# EAGLE design PhoneRinger_v1-2 (EAGLE 9.6.2)

## Sheet 1 of 2
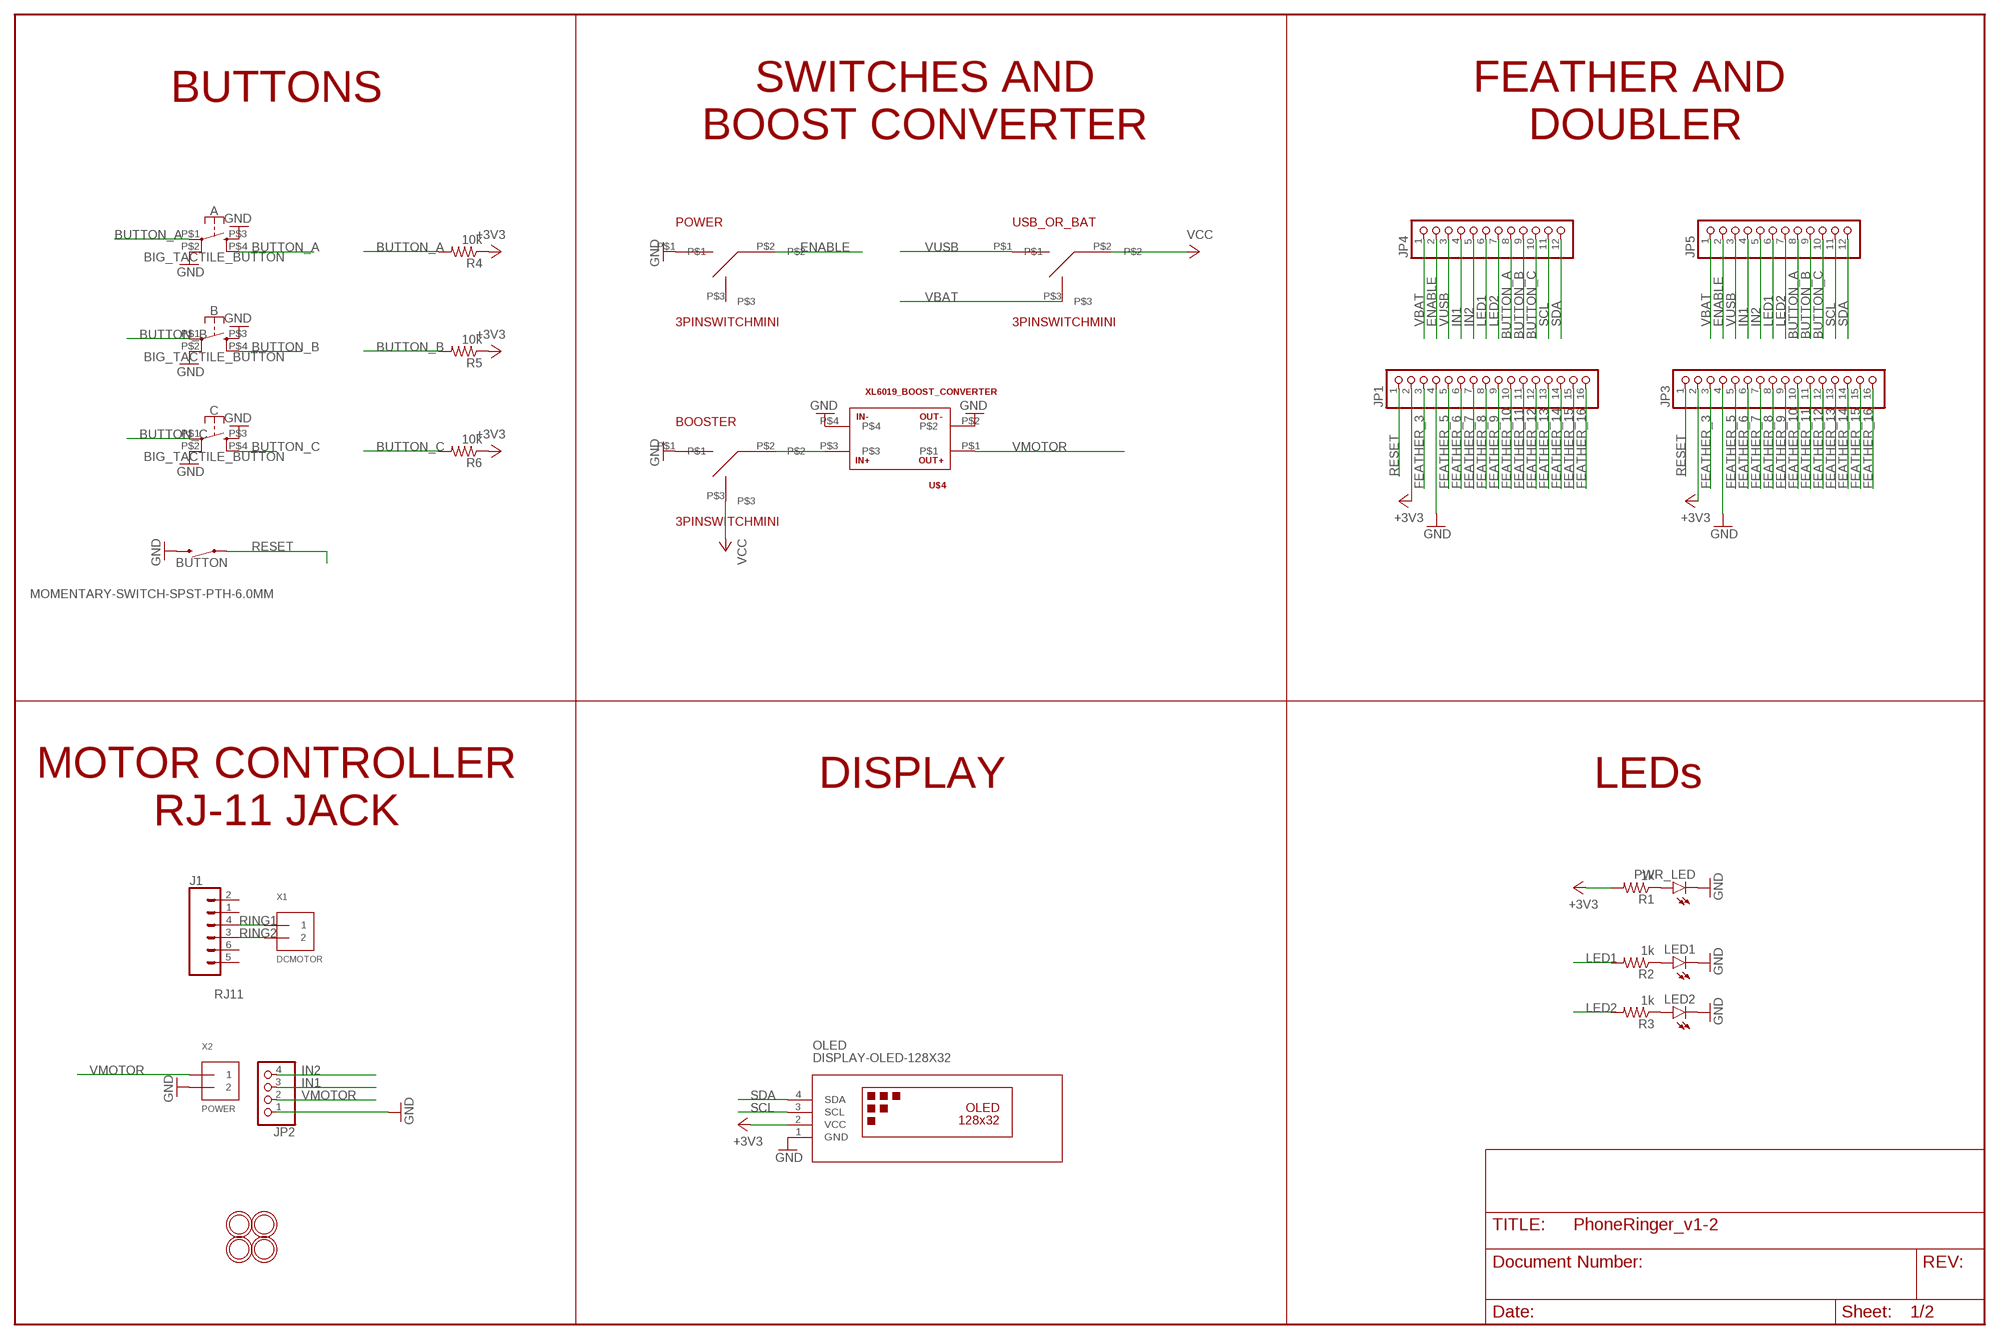
[diagram p0: schematic, sheet 1]

### Parts
A  BIG_TACTILE_BUTTON  [BIG_TACTILE_BUTTON_FP]
B  BIG_TACTILE_BUTTON  [BIG_TACTILE_BUTTON_FP]
BOOSTER  3PINSWITCHMINI  [3PINMINI]
BUTTON  MOMENTARY-SWITCH-SPST-PTH-6.0MM  [TACTILE_SWITCH_PTH_6.0MM]
C  BIG_TACTILE_BUTTON  [BIG_TACTILE_BUTTON_FP]
J1  RJ11  RJ11-6  [RJ11-6]
JP1  HEADER-1X16_76MIL  [1X16_ROUND_76MIL]
JP2  HEADER-1X476MIL  [1X04_ROUND_76]
JP3  HEADER-1X16_76MIL  [1X16_ROUND_76MIL]
JP4  HEADER-1X1276MIL  [1X12_ROUND_76MIL]
JP5  HEADER-1X1276MIL  [1X12_ROUND_76MIL]
LED1  LED5MM  [LED5MM]
LED2  LED5MM  [LED5MM]
OLED  DISPLAY-OLED-128X32  [DISPLAY-OLED-128X32]
POWER  3PINSWITCHMINI  [3PINMINI]
PWR_LED  LED5MM  [LED5MM]
R1  1k  R-US_0207/10  [0207/10]
R2  1k  R-US_0207/10  [0207/10]
R3  1k  R-US_0207/10  [0207/10]
R4  10k  R-US_0207/10  [0207/10]
R5  10k  R-US_0207/10  [0207/10]
R6  10k  R-US_0207/10  [0207/10]
U$4  XL6019_BOOST_CONVERTER  [XL6019_FP]
U$5  MICROBUILDER_MOUNTINGHOLE2.5_THICK  [MICROBUILDER_MOUNTINGHOLE_2.5_PLATED_THICK]
U$6  MICROBUILDER_MOUNTINGHOLE2.5_THICK  [MICROBUILDER_MOUNTINGHOLE_2.5_PLATED_THICK]
U$7  MICROBUILDER_MOUNTINGHOLE2.5_THICK  [MICROBUILDER_MOUNTINGHOLE_2.5_PLATED_THICK]
U$8  MICROBUILDER_MOUNTINGHOLE2.5_THICK  [MICROBUILDER_MOUNTINGHOLE_2.5_PLATED_THICK]
USB_OR_BAT  3PINSWITCHMINI  [3PINMINI]
X1  DCMOTOR  TERMBLOCK_1X2  [TERMBLOCK_1X2-3.5MM]
X2  POWER  TERMBLOCK_1X2  [TERMBLOCK_1X2-3.5MM]

### Nets
+3V3 [PWR]: JP1.2 JP3.2 OLED.2(VCC) R1.2 R4.1 R5.1 R6.1
BUTTON_A: A.P$1 A.P$4 JP4.8 JP5.8 R4.2
BUTTON_B: B.P$1 B.P$4 JP4.9 JP5.9 R5.2
BUTTON_C: C.P$1 C.P$4 JP4.10 JP5.10 R6.2
ENABLE: JP4.2 JP5.2 POWER.P$2
FEATHER_3: JP1.3 JP3.3
FEATHER_5: JP1.5 JP3.5
FEATHER_6: JP1.6 JP3.6
FEATHER_7: JP1.7 JP3.7
FEATHER_8: JP1.8 JP3.8
FEATHER_9: JP1.9 JP3.9
FEATHER_10: JP1.10 JP3.10
FEATHER_11: JP1.11 JP3.11
FEATHER_12: JP1.12 JP3.12
FEATHER_13: JP1.13 JP3.13
FEATHER_14: JP1.14 JP3.14
FEATHER_15: JP1.15 JP3.15
FEATHER_16: JP1.16 JP3.16
GND [PWR]: A.P$2 A.P$3 B.P$2 B.P$3 BOOSTER.P$1 BUTTON.3 C.P$2 C.P$3 JP1.4 JP2.1 JP3.4 LED1.K(C) LED2.K(C) OLED.1(GND) POWER.P$1 PWR_LED.K(C) U$4.P$2 U$4.P$4 X2.2
IN1: JP2.3 JP4.4 JP5.4
IN2: JP2.4 JP4.5 JP5.5
LED1: JP4.6 JP5.6 R2.2
LED2: JP4.7 JP5.7 R3.2
N$1: PWR_LED.A R1.1
N$2: LED1.A R2.1
N$3: LED2.A R3.1
N$8: BOOSTER.P$2 U$4.P$3
RESET: BUTTON.1 JP1.1 JP3.1
RING1 [PWR]: J1.4 X1.1
RING2 [PWR]: J1.3 X1.2
SCL: JP4.11 JP5.11 OLED.3(SCL)
SDA: JP4.12 JP5.12 OLED.4(SDA)
VBAT [PWR]: JP4.1 JP5.1 USB_OR_BAT.P$3
VCC: BOOSTER.P$3 USB_OR_BAT.P$2
VMOTOR [PWR]: JP2.2 U$4.P$1 X2.1
VUSB [PWR]: JP4.3 JP5.3 USB_OR_BAT.P$1
Unconnected: J1.1 J1.2 J1.5 J1.6 POWER.P$3

### Notes on the sheet
- BUTTONS
- SWITCHES AND
  BOOST CONVERTER
- FEATHER AND 
  DOUBLER
- DISPLAY | LEDs
- MOTOR CONTROLLER
  RJ-11 JACK

## Sheet 2 of 2

## Library data of the parts
A B C = TrophyParts:BIG_TACTILE_BUTTON
BOOSTER POWER USB_OR_BAT = TrophyParts:3PINSWITCHMINI
BUTTON = TrophyParts:MOMENTARY-SWITCH-SPST: Momentary Switch (Pushbutton) - SPST Normally-open (NO) SPST momentary switches (buttons, pushbuttons). Variants PTH-12MM - 12mm square, through-hole Momentary Pushbutton Switch - 12mm Square <https://www.sparkfun.com/products/9190> (COM-09190) PTH-6.0MM, PTH-6.0MM-KIT - 6.0mm square, through-hole Mini Pushbutton Switch <https://www.sparkfun.com/products/97> (COM-00097) KIT package intended for soldering kit's - only one side of pads' copper is exposed. PTH-RIGHT-ANGLE-KIT - Right-angle, through-hole Right Angle Tactile Button <https://www.sparkfun.com/products/10791> - Used on SparkFun BigTime Watch Kit <https://www.sparkfun.com/products/11734> SMD-12MM - 12mm square, surface-mount Tactile Button - SMD (12mm) <https://www.sparkfun.com/products/12993> (COM-12993) Used on SparkFun PicoBoard <https://www.sparkfun.com/products/11888> SMD-4.5MM - 4.5mm Square Trackball Switch Used on SparkFun Blackberry Trackballer Breakout <https://www.sparkfun.com/products/13169> SMD-4.6MMX2.8MM - 4.60mm x 2.80mm, surface mount Used on SparkFun SAMD21 Mini Breakout <https://www.sparkfun.com/products/13664> SMD-5.2MM, SMD-5.2-REDUNDANT - 5.2mm square, surface-mount Mini Pushbutton Switch - SMD <https://www.sparkfun.com/products/8720> (COM-08720) Used on Arduino Pro Mini <https://www.sparkfun.com/products/11114> REDUNDANT package connects both switch circuits together SMD-6.0X3.5MM - 6.0 x 3.5mm, surface mount Momentary Reset Switch SMD <https://www.sparkfun.com/products/8229> (COM-08229) SMD-6.2MM-TALL - 6.2mm square, surface mount Tactile Button - SMD (6mm) <https://www.sparkfun.com/products/12992> Used on SparkFun Digital Sandbox <https://www.sparkfun.com/products/12651> SMD-RIGHT-ANGLE - Right-angle, surface mount Used on SparkFun Block for Intel® Edison - Arduino <https://www.sparkfun.com/products/13036>; PROD_ID: SWCH-08441; SF_SKU: COM-00097
J1 = TrophyParts:RJ11-6: RJ11 Jack - 6 pin Commonly found on CAT3 devices and some Microchip programmers. Here is the connector we sell at SparkFun: RJ11 6-Pin Connector <https://www.sparkfun.com/products/132> (PRT-00132) Datasheet <http://www.sparkfun.com/datasheets/Prototyping/Connectors/RJ11-Datasheet.pdf> It is used on this SparkFun product: SparkFun Weather Shield <https://www.sparkfun.com/products/12081> (DEV-12081) Weather Meters <https://www.sparkfun.com/products/8942> (SEN-08942); PROD_ID: CONN-08590; SF_ID: PRT-00132
JP1 JP3 = microbuilder:HEADER-1X16: PIN HEADER
JP2 = microbuilder:HEADER-1X4: PIN HEADER
JP4 JP5 = microbuilder:HEADER-1X12
LED1 LED2 PWR_LED = led:LED: LED OSRAM: - CHIPLED LG R971, LG N971, LY N971, LG Q971, LY Q971, LO R971, LY R971 LH N974, LH R974 LS Q976, LO Q976, LY Q976 LO Q996 - Hyper CHIPLED LW Q18S LB Q993, LB Q99A, LB R99A - SideLED LS A670, LO A670, LY A670, LG A670, LP A670 LB A673, LV A673, LT A673, LW A673 LH A674 LY A675 LS A676, LA A676, LO A676, LY A676, LW A676 LS A679, LY A679, LG A679 - Hyper Micro SIDELED® LS Y876, LA Y876, LO Y876, LY Y876 LT Y87S - SmartLED LW L88C, LW L88S LB L89C, LB L89S, LG L890 LS L89K, LO L89K, LY L89K LS L896, LA L896, LO L896, LY L896 - TOPLED LS T670, LO T670, LY T670, LG T670, LP T670 LSG T670, LSP T670, LSY T670, LOP T670, LYG T670 LG T671, LOG T671, LSG T671 LB T673, LV T673, LT T673, LW T673 LH T674 LS T676, LA T676, LO T676, LY T676, LB T676, LH T676, LSB T676, LW T676 LB T67C, LV T67C, LT T67C, LS T67K, LO T67K, LY T67K, LW E67C LS E67B, LA E67B, LO E67B, LY E67B, LB E67C, LV E67C, LT E67C LW T67C LS T679, LY T679, LG T679 LS T770, LO T770, LY T770, LG T770, LP T770 LB T773, LV T773, LT T773, LW T773 LH T774 LS E675, LA E675, LY E675, LS T675 LS T776, LA T776, LO T776, LY T776, LB T776 LHGB T686 LT T68C, LB T68C - Hyper Mini TOPLED® LB M676 - Mini TOPLED Santana® LG M470 LS M47K, LO M47K, LY M47K Source: http://www.osram.convergy.de LUXEON: - LUMILED® LXK2-PW12-R00, LXK2-PW12-S00, LXK2-PW14-U00, LXK2-PW14-V00 LXK2-PM12-R00, LXK2-PM12-S00, LXK2-PM14-U00 LXK2-PE12-Q00, LXK2-PE12-R00, LXK2-PE12-S00, LXK2-PE14-T00, LXK2-PE14-U00 LXK2-PB12-K00, LXK2-PB12-L00, LXK2-PB12-M00, LXK2-PB14-N00, LXK2-PB14-P00, LXK2-PB14-Q00 LXK2-PR12-L00, LXK2-PR12-M00, LXK2-PR14-Q00, LXK2-PR14-R00 LXK2-PD12-Q00, LXK2-PD12-R00, LXK2-PD12-S00 LXK2-PH12-R00, LXK2-PH12-S00 LXK2-PL12-P00, LXK2-PL12-Q00, LXK2-PL12-R00 Source: www.luxeon.com KINGBRIGHT: KA-3528ASYC Source: www.kingbright.com
OLED = Hatch2020:DISPLAY-OLED-128X32: 128x32 Dot Matrix OLED Module with I2C interface based on SSD1306 chip More details available here: http://www.tinyosshop.com/index.php?route=product/product&product_id=953 Schematic available here: http://www.tinyosshop.com/datasheet/OLED%2012832.pdf SSD1306 datasheet: https://cdn-shop.adafruit.com/datasheets/SSD1306.pdf Click here to find device on ebay.com <http://www.ebay.com/sch/oled+display+128x32+i2c>
R1-R6 = rcl:R-US_: RESISTOR, American symbol; SPICEPREFIX: R
U$4 = TrophyParts:XL6019_BOOST_CONVERTER
U$5-U$8 = OLED_2:MICROBUILDER_MOUNTINGHOLE: Mounting Hole For #2 screws (0.086"/2.18mm width, 0.094"/2.4mm hole) use 2.5mm; BOM: EXCLUDE
X1 X2 = microbuilder:TERMBLOCK_1X2: 3.5mm Terminal block http://www.ladyada.net/library/pcb/eaglelibrary.html

## Net classes
1 PWR: width 0.508 mm

## Board
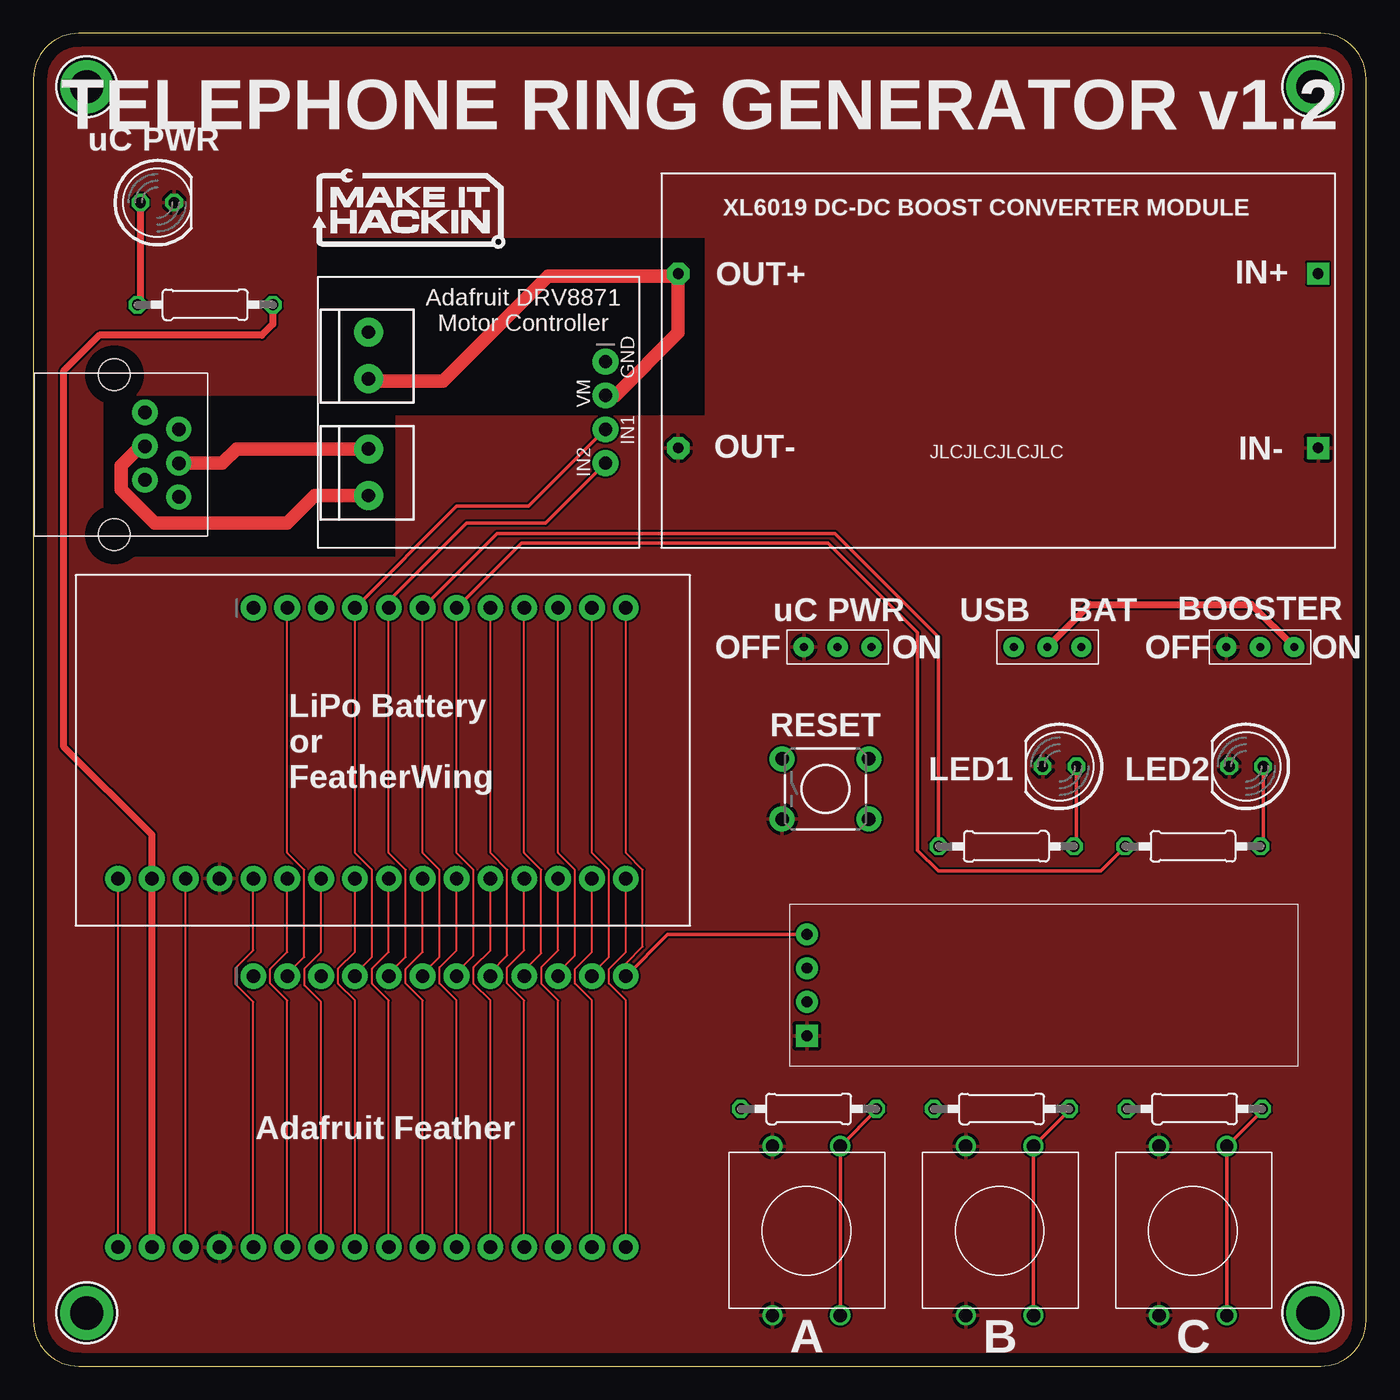
[diagram p1: board, top side]
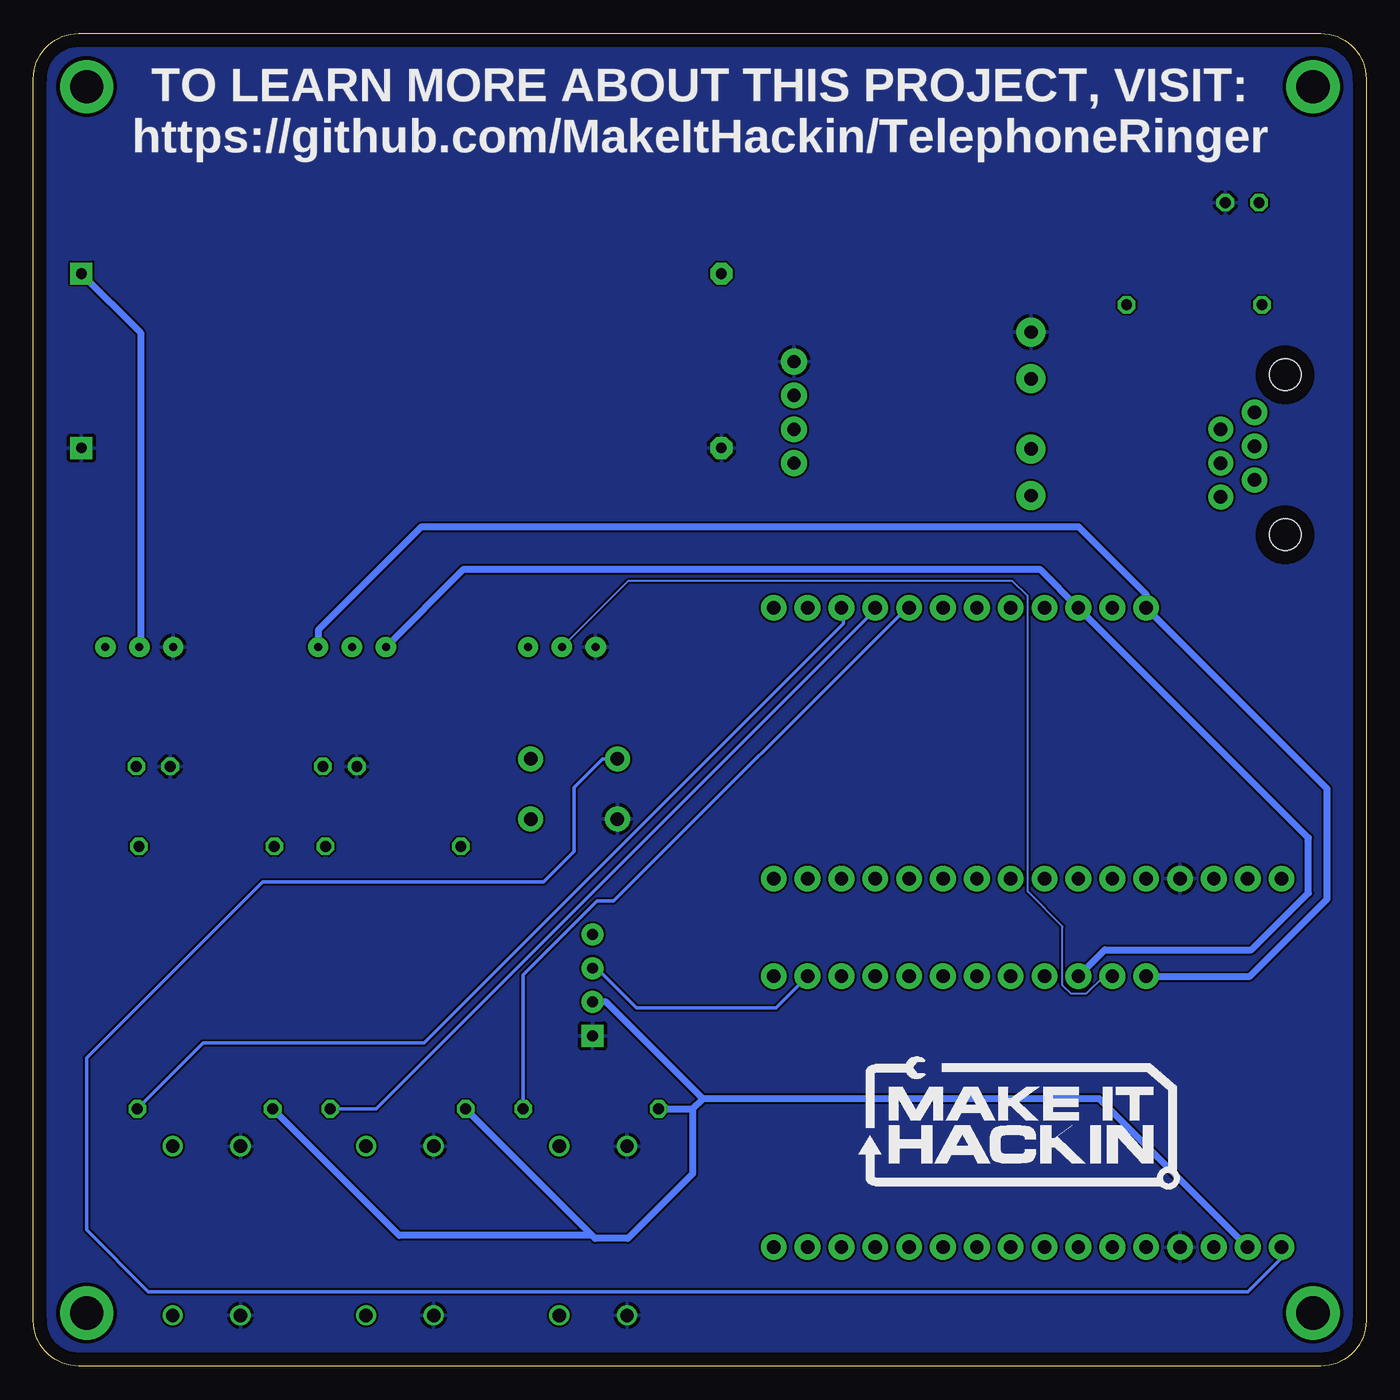
[diagram p2: board, bottom side, seen from below]

Size 100 x 100 mm. Coordinates in mm from the lower left corner, seen from the top.
Outline: 0,96.59 0,3.41 arc90 3.41,0 96.59,0 arc90 100,3.41 100,96.59 arc90 96.59,100 3.41,100 arc90 0,96.59
Copper layers (1*16): Top 0.035mm / dielectric 1.5mm / Bottom 0.035mm
Design rules "default": minimum track width 6mil, minimum drill 0.35mm, track to track 6mil, track to pad 6mil, pad to pad 6mil, via to via 6mil, smd to smd 6mil, copper to edge 40mil, drill to drill 6mil, minimum pad ring 10mil, minimum via ring 8mil, stop-mask expansion 4mil, vias tented up to drill 0mil, thermal gap 10mil
tRestrict: area 5.3,60.8 to 27.2,72.8; area 21.3,71.4 to 50.3,84.6

### Footprints (pad centres in the part's own frame; a part is rotated, then mirrored left to right if it is on the bottom)
BIG_TACTILE_BUTTON_FP = drill 1: P$1 2.54,-6.35; P$2 -2.54,-6.35; P$3 -2.54,6.35; P$4 2.54,6.35
3PINMINI = drill 0.6 pad 1.524: P$1 1.27,3.81; P$2 3.81,3.81; P$3 6.35,3.81
TACTILE_SWITCH_PTH_6.0MM = drill 1.016 pad 1.88: 1 -3.251,2.261; 2 3.251,2.261; 3 -3.251,-2.261; 4 3.251,-2.261
RJ11-6 = drill 1.016 pad 1.88: 1 3.175,4.44; 2 1.905,1.9; 3 0.635,4.44; 4 -0.635,1.9; 5 -1.905,4.44; 6 -3.175,1.9 | hole 2.36: -6,-0.4; 6,-0.4
1X16_ROUND_76MIL = drill 1 pad 1.93: 1 -19.05,0; 2 -16.51,0; 3 -13.97,0; 4 -11.43,0; 5 -8.89,0; 6 -6.35,0; 7 -3.81,0; 8 -1.27,0; 9 1.27,0; 10 3.81,0; 11 6.35,0; 12 8.89,0; 13 11.43,0; 14 13.97,0; 15 16.51,0; 16 19.05,0
1X04_ROUND_76 = drill 1 pad 1.93: 1 -3.81,0; 2 -1.27,0; 3 1.27,0; 4 3.81,0
1X12_ROUND_76MIL = drill 1 pad 1.93: 1 -13.97,0; 2 -11.43,0; 3 -8.89,0; 4 -6.35,0; 5 -3.81,0; 6 -1.27,0; 7 1.27,0; 8 3.81,0; 9 6.35,0; 10 8.89,0; 11 11.43,0; 12 13.97,0
LED5MM = drill 0.813 octagon: A -1.27,0; K 1.27,0
DISPLAY-OLED-128X32 = drill 0.813 pad 1.651 square: 1 -17.78,-3.81 | drill 0.813 pad 1.651: 2 -17.78,-1.27; 3 -17.78,1.27; 4 -17.78,3.81
0207/10 = drill 0.813 octagon: 1 -5.08,0; 2 5.08,0
XL6019_FP = drill 0.813 pad 1.651 octagon: P$1 -23.368,6.985; P$2 -23.368,-6.096 | drill 0.813 pad 1.651 square: P$3 24.638,6.985; P$4 24.638,-6.096
MICROBUILDER_MOUNTINGHOLE_2.5_PLATED_THICK = drill 2.5 pad 4: P$1 0,0
TERMBLOCK_1X2-3.5MM = drill 1 pad 2.184: 1 1.8,0; 2 -1.7,0

### Placement (x,y rotation side)
A  58,10.16 0 top
B  72.5,10.16 0 top
BOOSTER  88.24,50.15 0 top
BUTTON  59.44,43.31 0 top
C  87,10.16 0 top
J1  6.48,68.39 270 top
JP1  25.4,8.94 0 top
JP2  42.93,71.56 270 top
JP3  25.4,36.58 0 top
JP4  30.48,29.26 0 top
JP5  30.48,56.9 0 top
LED1  77,45 180 top
LED2  91,45 180 top
OLED  75.82,28.59 0 top
POWER  56.53,50.15 0 top
PWR_LED  9.3,87.3 0 top
R1  12.89,79.63 0 top
R2  73,39 180 top
R3  87,39 180 top
R4  58.17,19.3 0 top
R5  72.64,19.3 0 top
R6  87.12,19.3 0 top
U$4  71.75,74.99 0 top
U$5  4,4 0 top
U$6  4,96 0 top
U$7  96,4 0 top
U$8  96,96 0 top
USB_OR_BAT  72.28,50.15 0 top
X1  25.15,67.12 270 top
X2  25.15,75.88 270 top

### Tracks (layer width: path | path; a pad name or v marks a point on that pad's centre or on a via)
+3V3
  Top 0.508: R1.2 17.97,78.17 17.15,77.35 4.96,77.35 2.26,74.65 2.26,46.51 8.89,39.88 JP3.2 JP1.2
  Bottom 0.508: JP1.2 20.02,20.07 49.77,20.07 | 49.77,20.07 57.02,27.32 OLED.2 | R4.1 50.53,19.3 | 50.53,19.3 49.77,20.07 | 67.31,19.3 R5.1 58.06,9.8 | 50.53,19.3 50.53,14.44 55.4,9.58 57.84,9.58 58.06,9.8 | 58.06,9.8 72.54,9.8 R6.1
BUTTON_A
  Top 0.152: JP4.8 34.29,29.55 35.56,30.82 35.56,37.25 34.29,38.52 JP5.8
  Top 0.254: A.P$4 60.54,16.31 | 60.54,16.31 A.P$1 | A.P$4 60.54,16.53 | 60.68,16.45 60.54,16.31 | A.P$4 63.25,19.22 R4.2
  Bottom 0.254: JP5.8 34.47,56.9 56.46,34.9 57.71,34.9 63.25,29.36 R4.2
BUTTON_B
  Top 0.152: JP4.9 36.83,29.7 38.1,30.97 38.1,37.25 36.83,38.52 JP5.9
  Top 0.254: B.P$1 B.P$4 77.72,19.19 R5.2
  Bottom 0.254: JP5.9 36.98,56.74 36.98,56.62 74.3,19.3 R5.2
BUTTON_C
  Top 0.152: JP4.10 39.37,29.55 40.64,30.82 40.64,37.25 39.37,38.52 JP5.10
  Top 0.254: C.P$1 C.P$4 92.2,19.17 R6.2
  Bottom 0.254: JP5.10 39.22,56.74 39.22,55.7 70.67,24.26 87.25,24.26 R6.2
ENABLE
  Top 0.152: JP4.2 19.05,29.42 20.32,30.69 20.32,37.25 19.05,38.52 JP5.2
  Bottom 0.152: JP4.2 19.7,29.26 21.02,27.94 22.14,27.94 22.78,28.59 22.78,32.99 25.4,35.61 25.4,57.77 26.53,58.9 55.4,58.9 POWER.P$2
  Bottom 0.254: 19.1,29.26 JP4.2
FEATHER_3
  Top 0.152: JP1.3 JP3.3
FEATHER_5
  Top 0.152: JP1.5 16.51,27.32 15.19,28.64 15.19,29.88 16.51,31.2 JP3.5
FEATHER_6
  Top 0.152: JP1.6 19.05,27.44 17.78,28.71 17.78,29.8 19.05,31.07 JP3.6
FEATHER_7
  Top 0.152: JP1.7 21.59,27.32 20.34,28.56 20.34,29.83 21.59,31.07 JP3.7
FEATHER_8
  Top 0.152: JP1.8 24.13,27.44 22.89,28.69 22.89,29.83 24.13,31.07 JP3.8
FEATHER_9
  Top 0.152: JP1.9 26.67,27.44 25.43,28.69 25.43,29.83 26.67,31.07 JP3.9
FEATHER_10
  Top 0.152: JP1.10 29.21,27.44 27.94,28.71 27.94,29.8 29.21,31.07 JP3.10
FEATHER_11
  Top 0.152: JP1.11 31.75,27.44 30.48,28.71 30.48,29.93 31.75,31.2 JP3.11
FEATHER_12
  Top 0.152: JP1.12 34.29,27.44 33.05,28.69 33.05,29.95 34.29,31.2 JP3.12
FEATHER_13
  Top 0.152: JP1.13 36.83,27.44 35.56,28.71 35.56,29.93 36.83,31.2 JP3.13
FEATHER_14
  Top 0.152: JP1.14 39.37,27.44 38.12,28.69 38.12,29.95 39.37,31.2 JP3.14
FEATHER_15
  Top 0.152: JP1.15 41.91,27.44 40.64,28.71 40.64,29.8 41.91,31.07 JP3.15
FEATHER_16
  Top 0.152: JP1.16 44.45,27.44 43.18,28.71 43.18,29.8 44.45,31.07 JP3.16
GND
  pour Top: -1.27,100.33 101.35,100.33 arc-90 101.6,100.08 101.6,-1.27 -1.02,-1.27 arc-90 -1.27,-1.02
  pour Bottom: -1.27,101.6 102.62,101.6 arc-90 102.87,101.35 102.87,-2.54 -2.29,-2.54 arc-90 -2.54,-2.29 -2.54,101.6
IN1
  Top 0.152: JP4.4 24.13,29.42 25.4,30.69 25.4,37.25 24.13,38.52 JP5.4
  Top 0.254: JP2.3 37.15,64.52 31.75,64.52 JP5.4
IN2
  Top 0.152: JP4.5 26.67,29.42 27.94,30.69 27.94,37.25 26.67,38.52 JP5.5
  Top 0.254: JP5.5 26.67,57.4 32.51,63.25 38.42,63.25 JP2.4
LED1
  Top 0.152: JP4.6 29.21,29.42 30.48,30.69 30.48,37.25 29.21,38.52 JP5.6
  Top 0.254: JP5.6 34.8,62.48 60.15,62.48 67.92,54.71 R2.2
LED2
  Top 0.152: JP4.7 31.75,29.55 33.02,30.82 33.02,37.25 31.75,38.52 JP5.7
  Top 0.254: JP5.7 36.63,61.77 59.61,61.77 66.34,55.04 66.34,38.71 67.9,37.16 80.08,37.16 R3.2
N$1
  Top 0.152: 8.03,79.85 R1.1
  Top 0.508: PWR_LED.A 8.03,79.85
N$2
  Top 0.254: LED1.A 78.27,39.19 R2.1
N$3
  Top 0.254: LED2.A 92.27,39.19 R3.1
N$8
  Bottom 0.508: U$4.P$3 91.95,77.53 91.95,54.06 BOOSTER.P$2
RESET
  Top 0.152: JP1.1 JP3.1
  Bottom 0.254: 56.19,45.16 BUTTON.1 57.3,45.57 59.44,43.43 59.44,38.61 61.72,36.32 82.8,36.32 96.01,23.11 96.01,10.24 91.36,5.59 8.89,5.59 6.35,8.13 JP1.1
RING1
  Top 0.762: 8.06,69.02 J1.4
  Top 1.016: X1.1 21.12,65.32 19.05,63.25 9.12,63.25 6.6,65.76 6.6,67.56 8.06,69.02
RING2
  Top 1.016: X1.2 15.24,68.82 14.18,67.75 J1.3
SCL
  Top 0.152: JP4.11 41.91,29.42 43.18,30.69 43.18,37.25 41.91,38.52 JP5.11
  Bottom 0.254: JP4.11 44.27,26.9 54.75,26.9 57.71,29.86 OLED.3
SDA
  Top 0.152: JP4.12 44.45,30.21 45.72,31.48 45.72,37.25 44.45,38.52 JP5.12
  Top 0.254: JP4.12 47.59,32.4 OLED.4
VBAT
  Bottom 0.508: USB_OR_BAT.P$3 78.63,55.23 70.87,62.99 21.59,62.99 16.51,57.91 JP5.1 2.92,43.31 2.92,35.05 8.72,29.26 JP4.1
VCC
  Top 0.508: USB_OR_BAT.P$2 79.28,57.15 91.39,57.15 BOOSTER.P$3
VMOTOR
  Top 0.762: U$4.P$1 48.2,81.79 | 25.31,73.91 X2.1
  Top 1.016: JP2.2 43.69,72.83 48.39,77.53 U$4.P$1 | 25.31,73.91 30.73,73.91 38.61,81.79 48.2,81.79
VUSB
  Bottom 0.508: USB_OR_BAT.P$1 67.71,59.79 24.49,59.79 JP5.3 4.34,39.65 4.34,35.5 8.6,31.24 19.61,31.24 JP4.3

### Text on the board
tPlace: TELEPHONE RING GENERATOR v1.2 | uC PWR | Adafruit DRV8871 / Motor Controller | GND | VM | IN1 | JLCJLCJLCJLC | IN2 | uC PWR | USB | BAT | OFF | ON | OFF | ON | RESET | LED1 | LED2 | LiPo Battery / or / FeatherWing | Adafruit Feather
bPlace: TO LEARN MORE ABOUT THIS PROJECT, VISIT: / https://github.com/MakeItHackin/TelephoneRinger